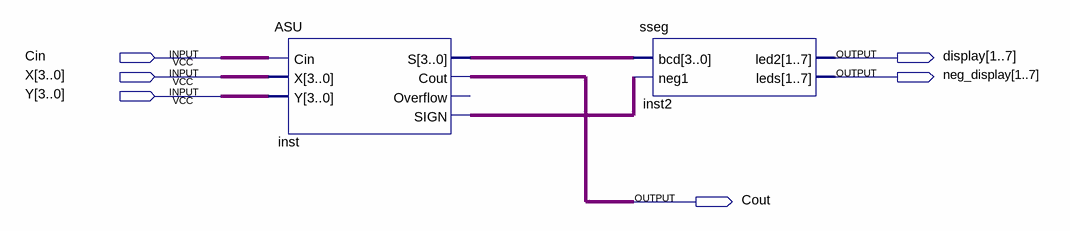
[diagram p0: schematic sheet]
// Quartus schematic CombinedASU1.bdf as structural Verilog: 2 symbols, 6 pins
module CombinedASU1 (
  input  Cin,
  input  [3:0] X,
  input  [3:0] Y,
  output [1:7] display,
  output [1:7] neg_display,
  output Cout
);

  wire inst_sign;
  wire [3:0] inst_s;

  ASU inst (.Cin(Cin), .X(X), .Y(Y), .S(inst_s), .Cout(Cout), .SIGN(inst_sign));  // open: Overflow
  sseg inst2 (.bcd(inst_s), .neg1(inst_sign), .led2(display), .leds(neg_display));
endmodule
